# Altium schematic sheet etapa5.SchDoc
size Letter
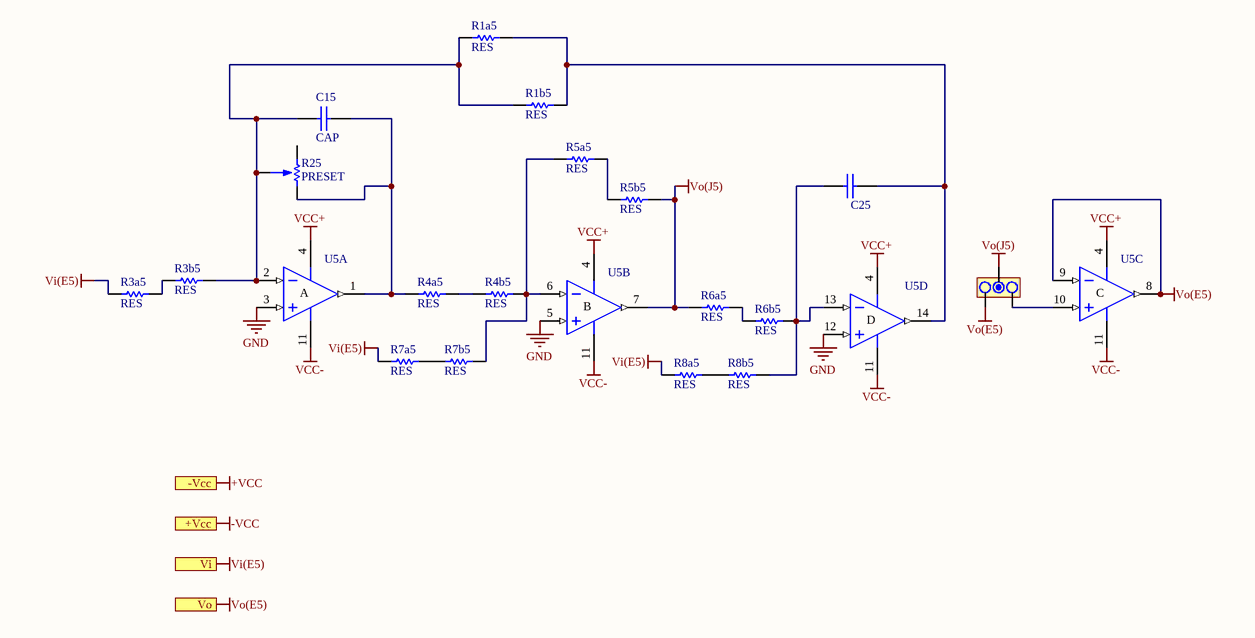
[diagram p0: etapa5.SchDoc]

## Parts
C15  CAP  [CAP200]
C25  CAP  [CAP200]  (value not drawn)
Jumper5  JUMPER  [JUMPER3]  (value not drawn)
R1a5  RES  [0805]
R1b5  RES  [0805]
R3a5  RES  [0805]
R3b5  RES  [0805]
R4a5  RES  [0805]
R4b5  RES  [0805]
R5a5  RES  [0805]
R5b5  RES  [0805]
R6a5  RES  [0805]
R6b5  RES  [0805]
R7a5  RES  [0805]
R7b5  RES  [0805]
R8a5  RES  [0805]
R8b5  RES  [0805]
R25  PRESET  [PRESET V]
U5  TL084N  [N014]  (value not drawn)  (parts A,B,C,D of 4)

## Ports
+Vcc, -Vcc, Vi, Vo

## Nets
+VCC: port -Vcc
-VCC: port +Vcc
GND: U5.3(IN+) U5.5(IN+) U5.12(IN+)
VCC+: U5.4(V+)
VCC-: U5.11(V-)
Vi(E5): R3a5.1 R7a5.1 R8a5.1 ; port Vi
Vo(E5): Jumper5.3 U5.8(OUT) U5.9(IN-) ; port Vo
Vo(J5): Jumper5.2 R5b5.2 R6a5.1 U5.7(OUT)
NetC15_1: C15.1 R1a5.1 R1b5.1 R3b5.2 R25.2 U5.2(IN-)
NetC15_2: C15.2 R4a5.1 R25.1 U5.1(OUT)
NetC25_1: C25.1 R6b5.2 R8b5.2 U5.13(IN-)
NetC25_2: C25.2 R1a5.2 R1b5.2 U5.14(OUT)
NetJumper5_1: Jumper5.1 U5.10(IN+)
NetR3a5_2: R3a5.2 R3b5.1
NetR4a5_2: R4a5.2 R4b5.1
NetR4b5_2: R4b5.2 R5a5.1 R7b5.2 U5.6(IN-)
NetR5a5_2: R5a5.2 R5b5.1
NetR6a5_2: R6a5.2 R6b5.1
NetR7a5_2: R7a5.2 R7b5.1
NetR8a5_2: R8a5.2 R8b5.1

Not connected (* = marked no-connect by the designer): R25 3

## Notes on the sheet
- (in symbol TL084N, part A) A
- (in symbol TL084N, part B) B
- (in symbol TL084N, part C) C
- (in symbol TL084N, part D) D

## Library data of the parts
Jumper5 = JUMPER3
U5 = TL084N: JFET-Input Operational Amplifier; Published: 16-Jan-2001; LatestRevisionDate: 04-Mar-2005; LatestRevisionNote: Stylized 3D Model Added.; DatasheetVersion: Feb-1999; PackageVersion: Oct-1995; PackageReference: N014; Publisher: Altium Limited; PackageDescription: DIP; 14 Leads; Row Spacing 7.62 mm; Pitch 2.54 mm; ComponentLink1Description: Manufacturer Link; ComponentLink1URL: http://www.ti.com/; ComponentLink2Description: Datasheet; ComponentLink2URL: http://www-s.ti.com/sc/ds/tl084.pdf